# EasyEDA schematic 1-Schematic_espled2.json
TITLE: firefly_v2; REV: 1.0; Date: 2019-03-06; Sheet: 1/1; Drawn By: Alex Vanderpot; Company: Vanderpot LLC
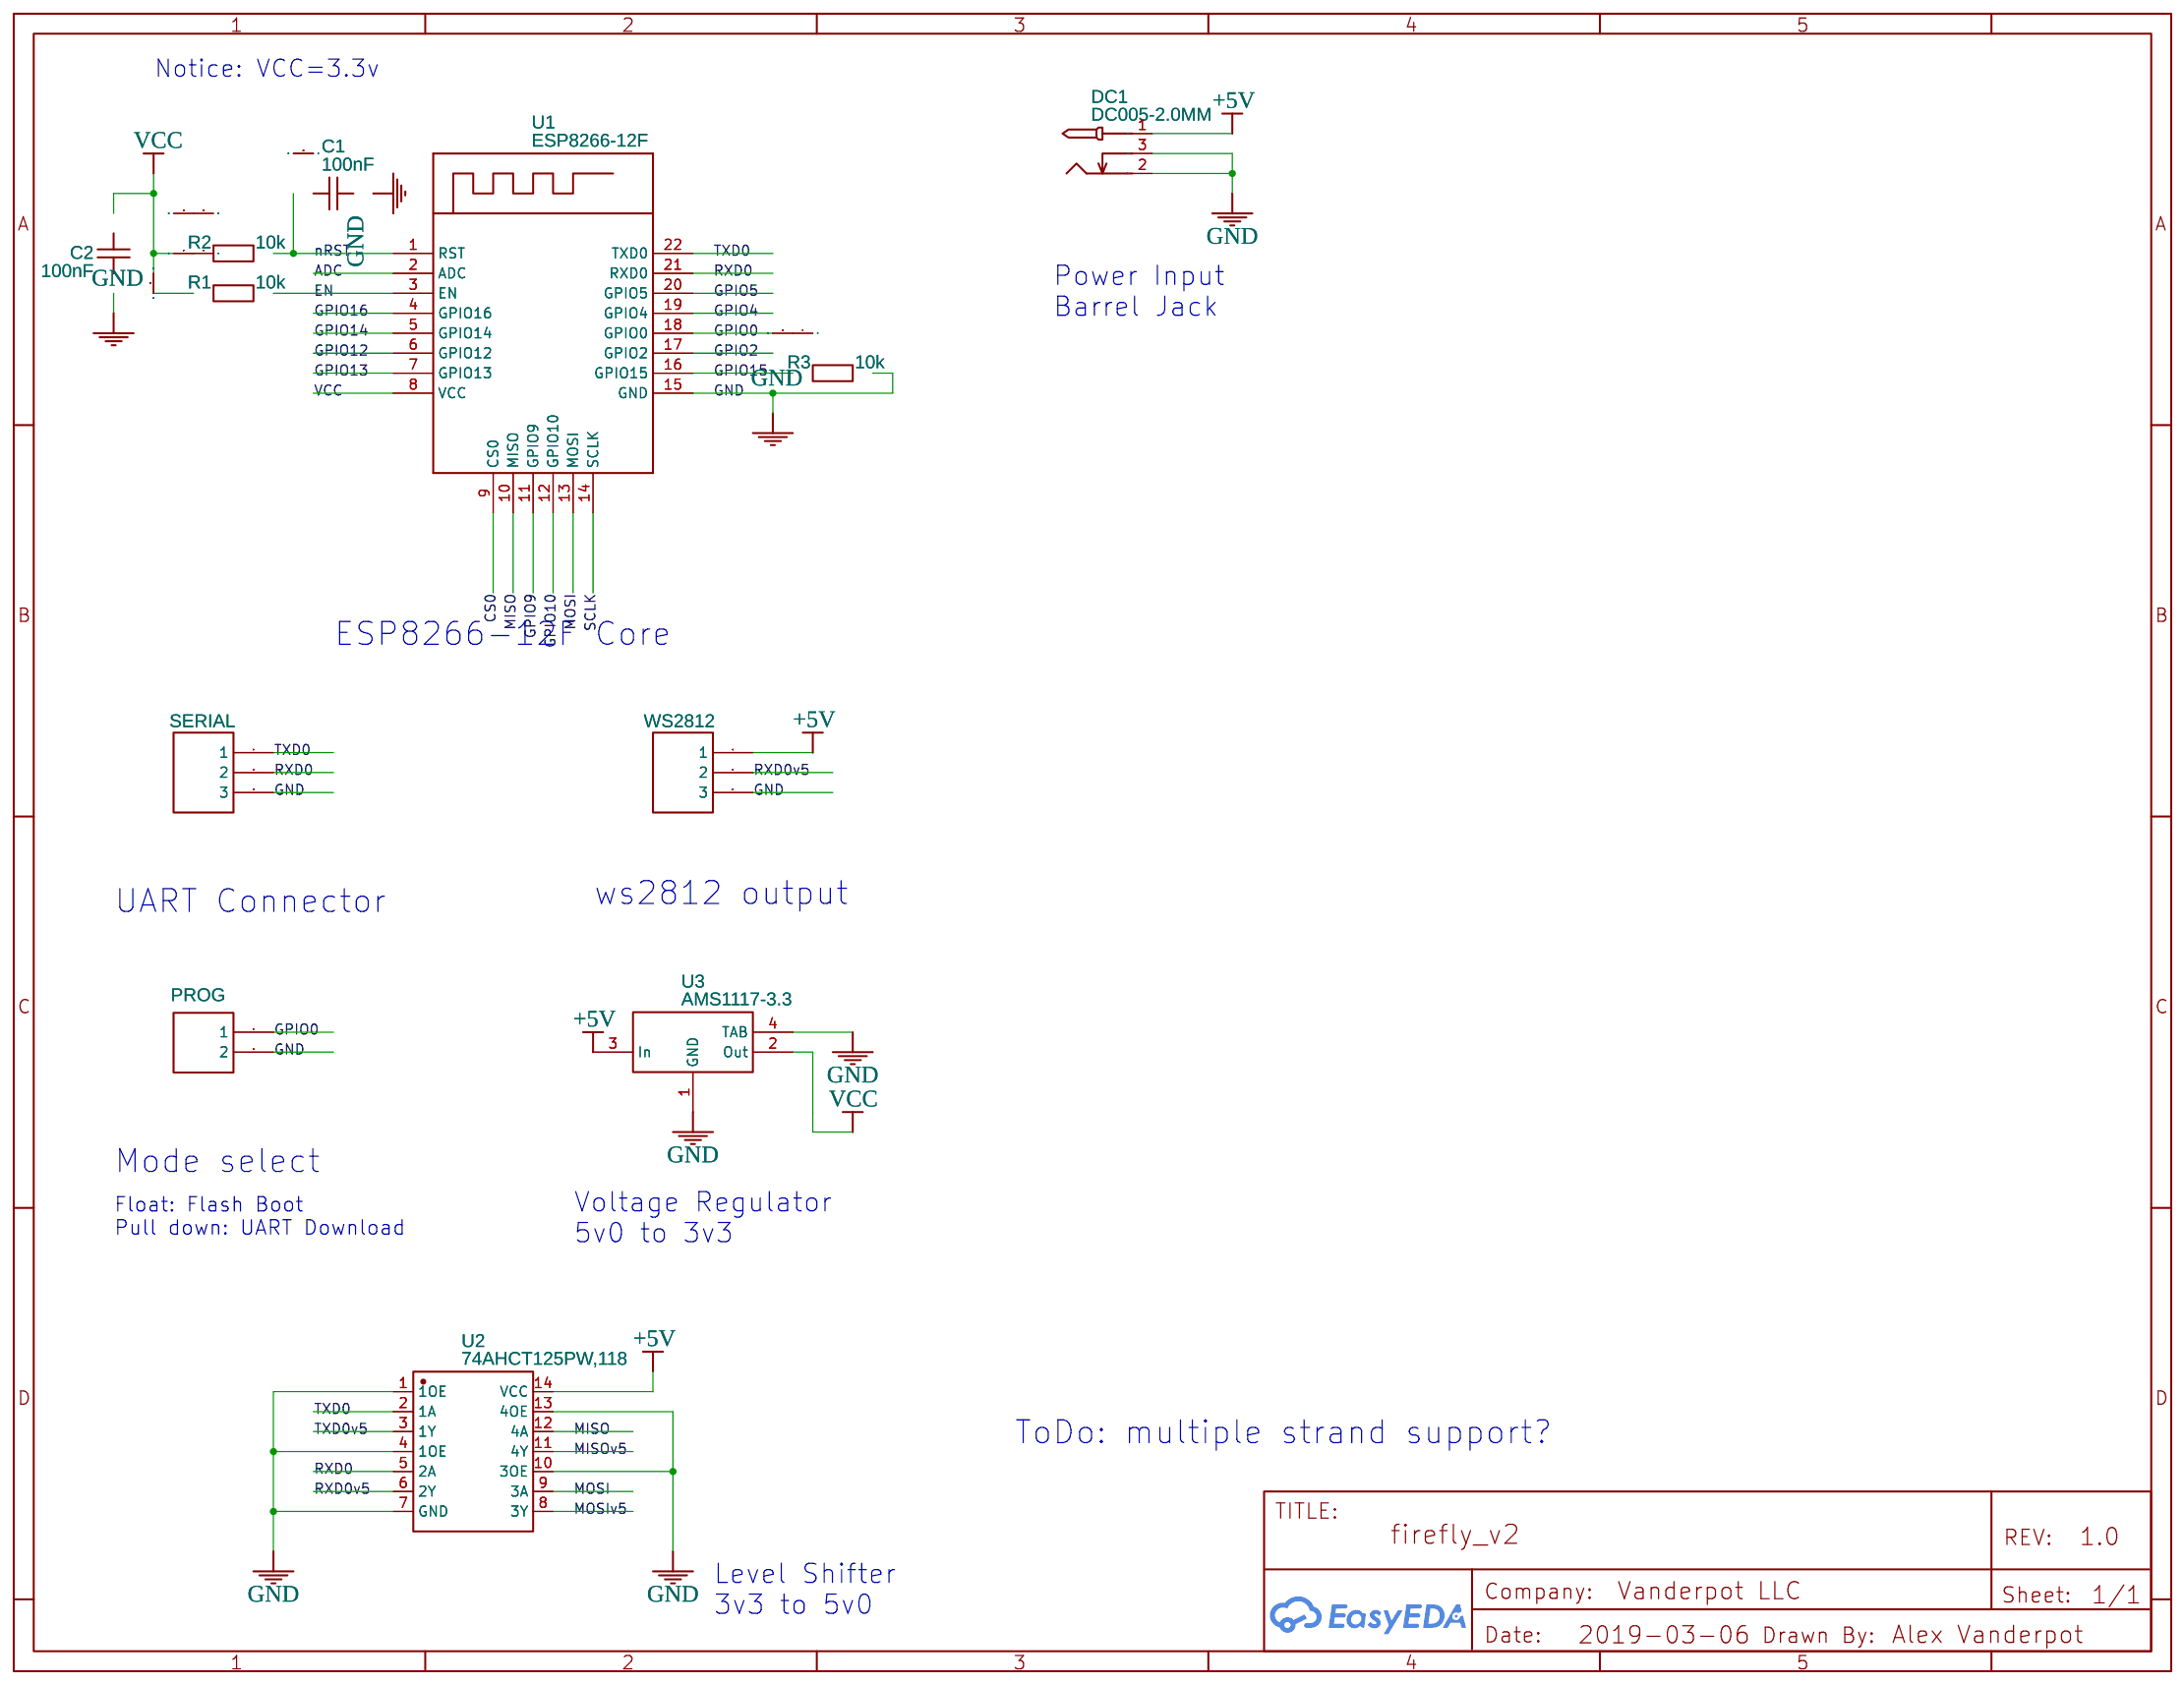
[diagram p0: schematic sheet]

## Parts
C1  100nF  [0805]
C2  100nF  [0805]
DC1  DC005-2.0MM  [DC-5020]
PROG  P2  [HDR1X2]
R1  10k  [0805]
R2  10k  [0805]
R3  10k  [0805]
SERIAL  SIP3  [HDR1X3]
U1  ESP8266-12F  [LGA22-2.0-24X16MM]
U2  74AHCT125PW,118  [TSSOP-14]
U3  AMS1117-3.3  [SOT-223]
WS2812  SIP3  [HDR1X3]

## Library data of the parts
C1 = Capacitor: Manufacturer Part: ?
C2 = Capacitor
DC1 = -: Supplier: LCSC; Manufacturer: SOFNG; Supplier Part: C111567
PROG SERIAL WS2812 = -: catid: 20; Manufacturer Part: ?
R1-R3 = Resistor: Manufacturer Part: ?
U1 = -: SMD ESP8266 based WiFi module FCC/CE; catid: 20; Manufacturer Part: ESP8266-12F/ESP-12F; sourceId: K4gQpZzx7
U2 = -: Supplier: LCSC; Supplier Part: C148198; Manufacturer: Nexperia; Contributor: LCSC
U3 = -: sourceId: dwIGgezVh; Supplier: LCSC; Manufacturer: AMS; LCSC Assembly: Yes; image: //image.lceda.cn/szlcsc/C6186.jpg; Supplier Part: C6186

## Nets
+5V: DC1.1 U2.14(VCC) U3.3(In) WS2812.1
GND: C1.2 C2.1 DC1.2 DC1.3 PROG.2 R3.2 SERIAL.3 U1.15(GND) U2.1(1OE) U2.4(1OE) U2.7(GND) U2.10(3OE) U2.13(4OE) U3.1(GND) U3.4(TAB) WS2812.3
VCC: C2.2 R1.1 R2.1 U1.8(VCC) U3.2(Out)
ADC: U1.2(ADC)
CS0: U1.9(CS0)
EN: R1.2 U1.3(EN)
GPIO0: PROG.1 U1.18(GPIO0)
GPIO2: U1.17(GPIO2)
GPIO4: U1.19(GPIO4)
GPIO5: U1.20(GPIO5)
GPIO9: U1.11(GPIO9)
GPIO10: U1.12(GPIO10)
GPIO12: U1.6(GPIO12)
GPIO13: U1.7(GPIO13)
GPIO14: U1.5(GPIO14)
GPIO15: R3.1 U1.16(GPIO15)
GPIO16: U1.4(GPIO16)
MISO: U1.10(MISO) U2.12(4A)
MISOv5: U2.11(4Y)
MOSI: U1.13(MOSI) U2.9(3A)
MOSIv5: U2.8(3Y)
nRST: C1.1 R2.2 U1.1(RST)
RXD0: SERIAL.2 U1.21(RXD0) U2.5(2A)
RXD0v5: U2.6(2Y) WS2812.2
SCLK: U1.14(SCLK)
TXD0: SERIAL.1 U1.22(TXD0) U2.2(1A)
TXD0v5: U2.3(1Y)

## Notes on the sheet
- Notice: VCC=3.3v
- Power Input
  Barrel Jack
- ESP8266-12F Core
- UART Connector
- ws2812 output
- Mode select
- Float: Flash Boot
  Pull down: UART Download
- Voltage Regulator
  5v0 to 3v3
- ToDo: multiple strand support?
- Level Shifter
  3v3 to 5v0
